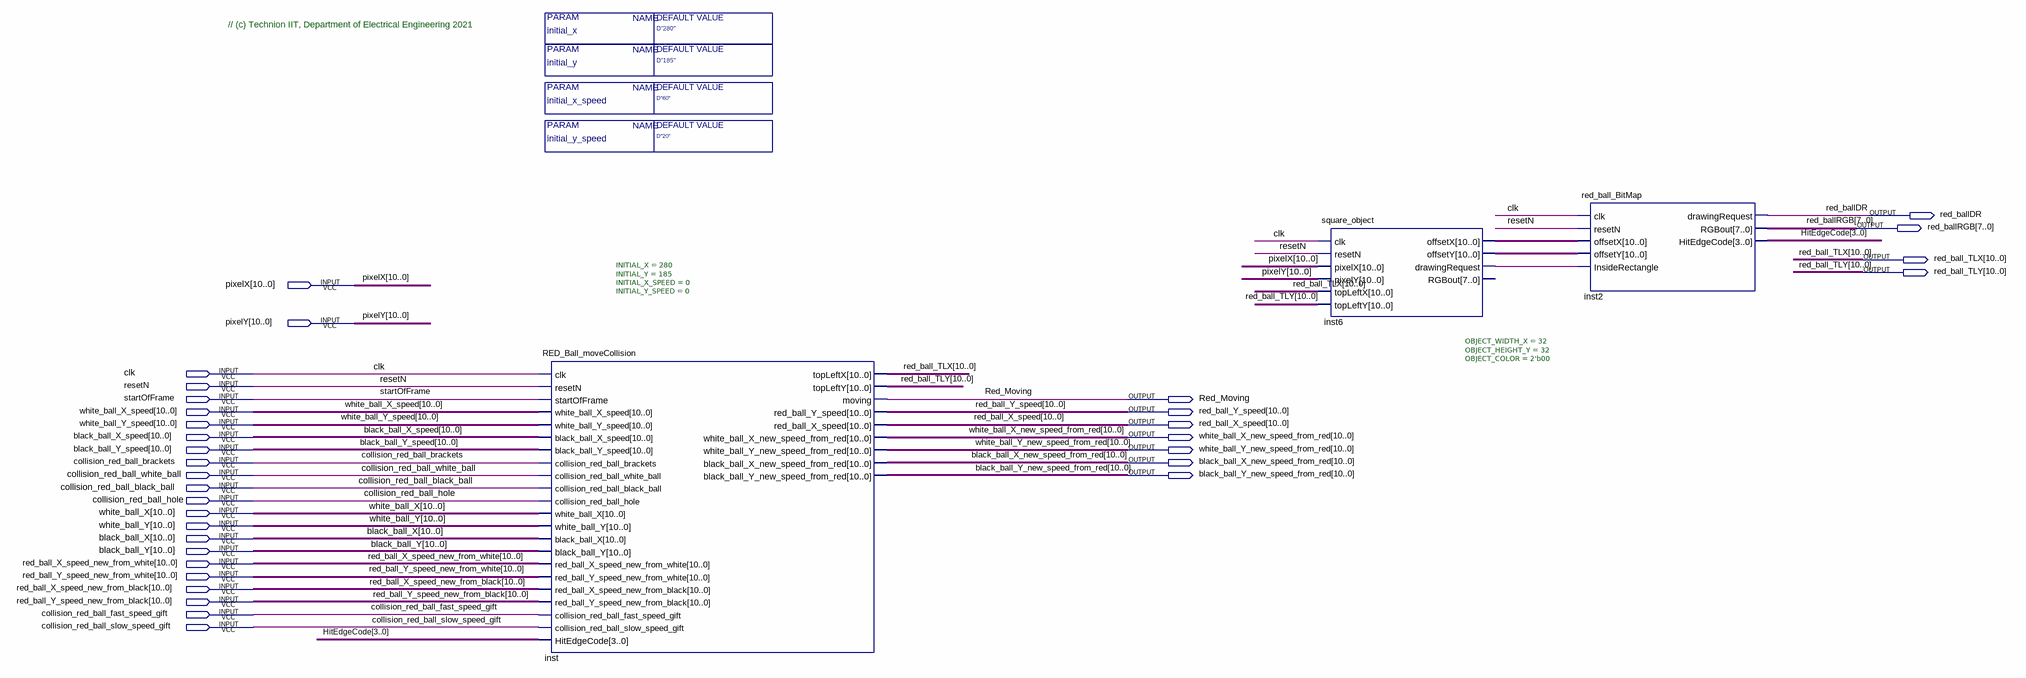
[diagram p0: schematic sheet]
// Quartus schematic red_ball_block.bdf as structural Verilog: 3 symbols, 34 pins
module red_ball_block #(parameter initial_x = "D\"280\"", parameter initial_y = "D\"185\"", parameter initial_x_speed = "D\"60\"", parameter initial_y_speed = "D\"20\"") (
  input  [10:0] pixelX,
  input  [10:0] pixelY,
  input  clk,
  input  resetN,
  input  startOfFrame,
  input  [10:0] white_ball_X_speed,
  input  [10:0] white_ball_Y_speed,
  input  [10:0] black_ball_X_speed,
  input  [10:0] black_ball_Y_speed,
  input  collision_red_ball_brackets,
  input  collision_red_ball_white_ball,
  input  collision_red_ball_black_ball,
  input  collision_red_ball_hole,
  input  [10:0] white_ball_X,
  input  [10:0] white_ball_Y,
  input  [10:0] black_ball_X,
  input  [10:0] black_ball_Y,
  input  [10:0] red_ball_X_speed_new_from_white,
  input  [10:0] red_ball_Y_speed_new_from_white,
  input  [10:0] red_ball_X_speed_new_from_black,
  input  [10:0] red_ball_Y_speed_new_from_black,
  input  collision_red_ball_fast_speed_gift,
  input  collision_red_ball_slow_speed_gift,
  output red_ballDR,
  output [7:0] red_ballRGB,
  output [10:0] red_ball_TLX,
  output [10:0] red_ball_TLY,
  output Red_Moving,
  output [10:0] red_ball_Y_speed,
  output [10:0] red_ball_X_speed,
  output [10:0] white_ball_X_new_speed_from_red,
  output [10:0] white_ball_Y_new_speed_from_red,
  output [10:0] black_ball_X_new_speed_from_red,
  output [10:0] black_ball_Y_new_speed_from_red
);

  wire inst6_drawingrequest;
  wire [3:0] HitEdgeCode;
  wire [10:0] inst6_offsetx, inst6_offsety;

  RED_Ball_moveCollision #(.INITIAL_X(280), .INITIAL_Y(185), .INITIAL_X_SPEED(0), .INITIAL_Y_SPEED(0)) inst (
    .clk(clk), .resetN(resetN), .startOfFrame(startOfFrame), .white_ball_X_speed(white_ball_X_speed),
    .white_ball_Y_speed(white_ball_Y_speed), .black_ball_X_speed(black_ball_X_speed),
    .black_ball_Y_speed(black_ball_Y_speed), .collision_red_ball_brackets(collision_red_ball_brackets),
    .collision_red_ball_white_ball(collision_red_ball_white_ball),
    .collision_red_ball_black_ball(collision_red_ball_black_ball),
    .collision_red_ball_hole(collision_red_ball_hole), .white_ball_X(white_ball_X),
    .white_ball_Y(white_ball_Y), .black_ball_X(black_ball_X), .black_ball_Y(black_ball_Y),
    .red_ball_X_speed_new_from_white(red_ball_X_speed_new_from_white),
    .red_ball_Y_speed_new_from_white(red_ball_Y_speed_new_from_white),
    .red_ball_X_speed_new_from_black(red_ball_X_speed_new_from_black),
    .red_ball_Y_speed_new_from_black(red_ball_Y_speed_new_from_black),
    .collision_red_ball_fast_speed_gift(collision_red_ball_fast_speed_gift),
    .collision_red_ball_slow_speed_gift(collision_red_ball_slow_speed_gift), .HitEdgeCode(HitEdgeCode),
    .topLeftX(red_ball_TLX), .topLeftY(red_ball_TLY), .moving(Red_Moving),
    .red_ball_Y_speed(red_ball_Y_speed), .red_ball_X_speed(red_ball_X_speed),
    .white_ball_X_new_speed_from_red(white_ball_X_new_speed_from_red),
    .white_ball_Y_new_speed_from_red(white_ball_Y_new_speed_from_red),
    .black_ball_X_new_speed_from_red(black_ball_X_new_speed_from_red),
    .black_ball_Y_new_speed_from_red(black_ball_Y_new_speed_from_red));
  square_object #(.OBJECT_WIDTH_X(32), .OBJECT_HEIGHT_Y(32), .OBJECT_COLOR(2'b00)) inst6 (
    .clk(clk), .resetN(resetN), .pixelX(pixelX), .pixelY(pixelY), .topLeftX(red_ball_TLX),
    .topLeftY(red_ball_TLY), .offsetX(inst6_offsetx), .offsetY(inst6_offsety),
    .drawingRequest(inst6_drawingrequest));  // open: RGBout
  red_ball_BitMap inst2 (
    .clk(clk), .resetN(resetN), .offsetX(inst6_offsetx), .offsetY(inst6_offsety),
    .InsideRectangle(inst6_drawingrequest), .drawingRequest(red_ballDR), .RGBout(red_ballRGB),
    .HitEdgeCode(HitEdgeCode));

  // Notes on the sheet:
  //   // (c) Technion IIT, Department of Electrical Engineering 2021
endmodule
